# Altium schematic sheet Ethernet-PHY.SchDoc
size A4; SheetNumber: 5; SheetTotal: 5
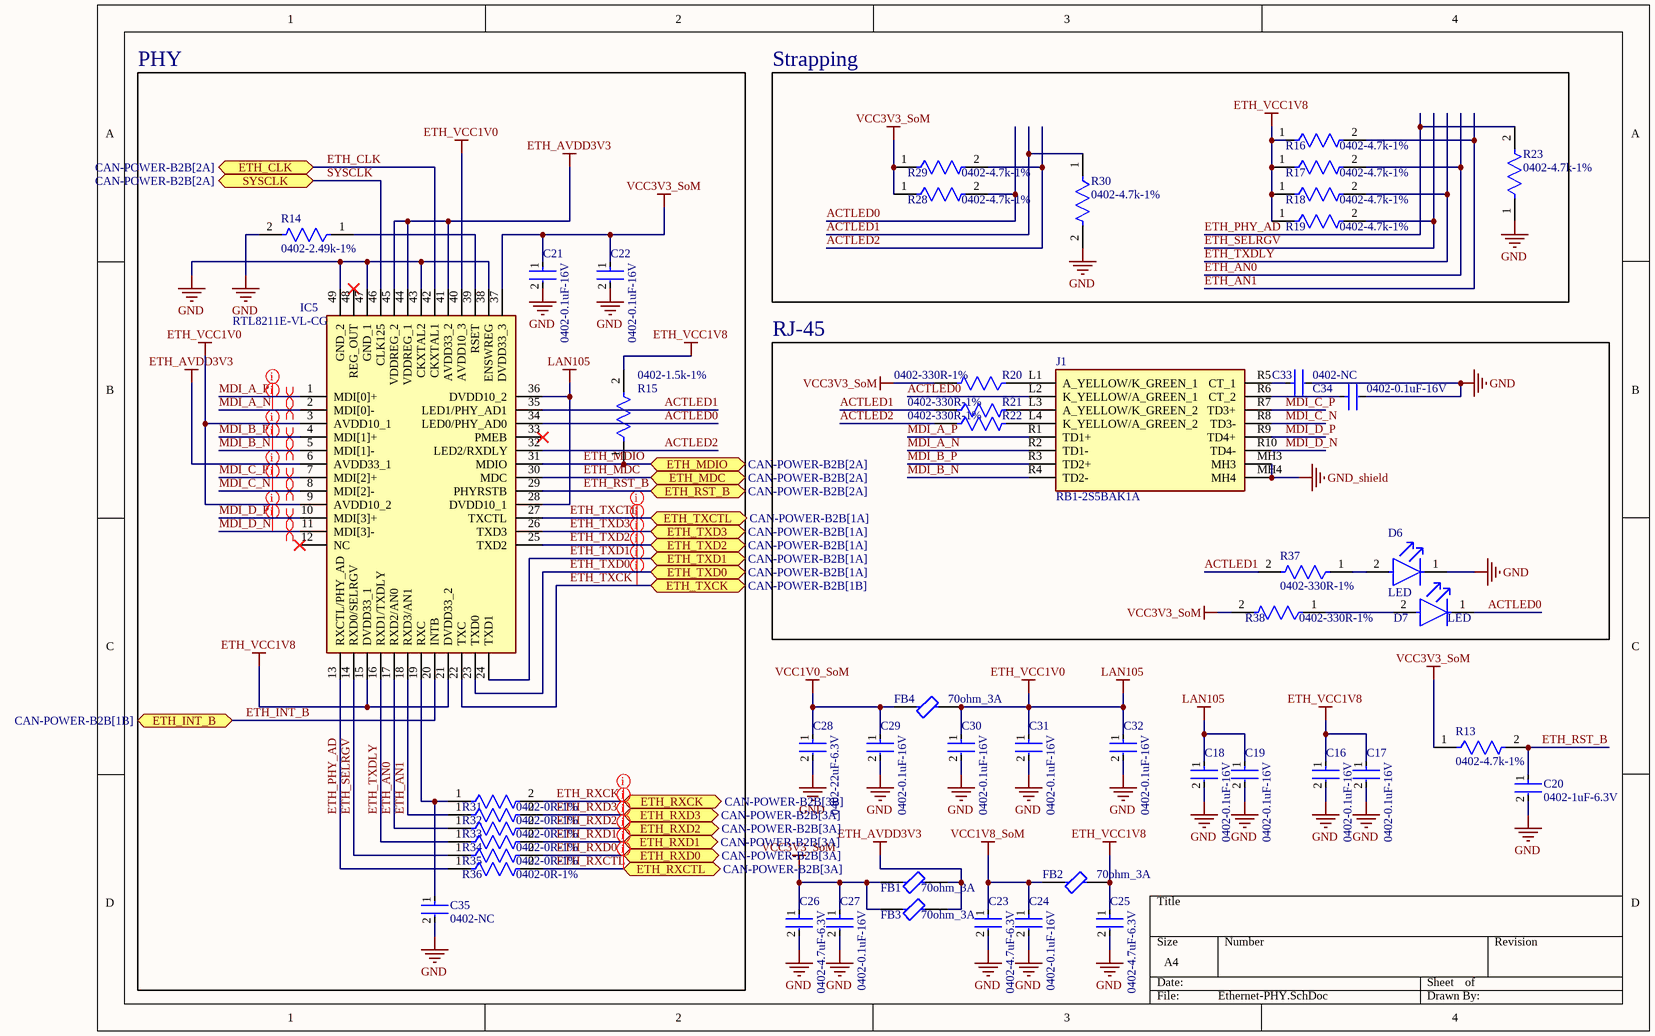
[diagram p0: Ethernet-PHY.SchDoc]

## Parts
C16  0402-0.1uF-16V  [FP-GRM155-0_05-IPC_A]
C17  0402-0.1uF-16V  [FP-GRM155-0_05-IPC_A]
C18  0402-0.1uF-16V  [FP-GRM155-0_05-IPC_A]
C19  0402-0.1uF-16V  [FP-GRM155-0_05-IPC_A]
C20  0402-1uF-6.3V  [FP-GRM155-0_05-IPC_A]
C21  0402-0.1uF-16V  [FP-GRM155-0_05-IPC_A]
C22  0402-0.1uF-16V  [FP-GRM155-0_05-IPC_A]
C23  0402-4.7uF-6.3V  [FP-GRM155-0_05-IPC_A]
C24  0402-0.1uF-16V  [FP-GRM155-0_05-IPC_A]
C25  0402-4.7uF-6.3V  [FP-GRM155-0_05-IPC_A]
C26  0402-4.7uF-6.3V  [FP-GRM155-0_05-IPC_A]
C27  0402-0.1uF-16V  [FP-GRM155-0_05-IPC_A]
C28  0402-22uF-6.3V  [FP-GRM155-0_05-IPC_A]
C29  0402-0.1uF-16V  [FP-GRM155-0_05-IPC_A]
C30  0402-0.1uF-16V  [FP-GRM155-0_05-IPC_A]
C31  0402-0.1uF-16V  [FP-GRM155-0_05-IPC_A]
C32  0402-0.1uF-16V  [FP-GRM155-0_05-IPC_A]
C33  0402-NC  [FP-GRM155-0_05-IPC_A]
C34  0402-0.1uF-16V  [FP-GRM155-0_05-IPC_A]
C35  0402-NC  [FP-GRM155-0_05-IPC_A]
D6  LED  [FP-APHHS1005CGCK-MFG]
D7  LED  [FP-APHHS1005CGCK-MFG]
FB1  70ohm_3A  [FP-MPZ2012-MFG]
FB2  70ohm_3A  [FP-MPZ2012-MFG]
FB3  70ohm_3A  [FP-MPZ2012-MFG]
FB4  70ohm_3A  [FP-MPZ2012-MFG]
IC5  RTL8211E-VL-CG  [QFN40P600X600X100-49N]
J1  RB1-2S5BAK1A  [RB12S5BAK1A]
R13  0402-4.7k-1%  [FP-CRCW0402-e3-IPC_C]
R14  0402-2.49k-1%  [FP-CRCW0402-e3-IPC_C]
R15  0402-1.5k-1%  [FP-CRCW0402-e3-IPC_C]
R16  0402-4.7k-1%  [FP-CRCW0402-e3-IPC_C]
R17  0402-4.7k-1%  [FP-CRCW0402-e3-IPC_C]
R18  0402-4.7k-1%  [FP-CRCW0402-e3-IPC_C]
R19  0402-4.7k-1%  [FP-CRCW0402-e3-IPC_C]
R20  0402-330R-1%  [FP-CRCW0402-e3-IPC_C]
R21  0402-330R-1%  [FP-CRCW0402-e3-IPC_C]
R22  0402-330R-1%  [FP-CRCW0402-e3-IPC_C]
R23  0402-4.7k-1%  [FP-CRCW0402-e3-IPC_C]
R28  0402-4.7k-1%  [FP-CRCW0402-e3-IPC_C]
R29  0402-4.7k-1%  [FP-CRCW0402-e3-IPC_C]
R30  0402-4.7k-1%  [FP-CRCW0402-e3-IPC_C]
R31  0402-0R-1%  [FP-CRCW0402-e3-IPC_C]
R32  0402-0R-1%  [FP-CRCW0402-e3-IPC_C]
R33  0402-0R-1%  [FP-CRCW0402-e3-IPC_C]
R34  0402-0R-1%  [FP-CRCW0402-e3-IPC_C]
R35  0402-0R-1%  [FP-CRCW0402-e3-IPC_C]
R36  0402-0R-1%  [FP-CRCW0402-e3-IPC_C]
R37  0402-330R-1%  [FP-CRCW0402-e3-IPC_C]
R38  0402-330R-1%  [FP-CRCW0402-e3-IPC_C]

## Blocks framed on the sheet
PHY: C21 C22 C35 IC5 R14 R15 R31-R36
Strapping: R16-R19 R23 R28-R30
RJ-45: C33 C34 D6 D7 J1 R20-R22 R37 R38

## Ports
ETH_CLK (bidir, see CAN-POWER-B2B[2A]), ETH_INT_B (bidir, see CAN-POWER-B2B[1B]), ETH_MDC (bidir, see CAN-POWER-B2B[2A]), ETH_MDIO (bidir, see CAN-POWER-B2B[2A]), ETH_RST_B (bidir, see CAN-POWER-B2B[2A]), ETH_RXCK (bidir, see CAN-POWER-B2B[3B]), ETH_RXCTL (bidir, see CAN-POWER-B2B[3A]), ETH_RXD0 (bidir, see CAN-POWER-B2B[3A]), ETH_RXD1 (bidir, see CAN-POWER-B2B[3A]), ETH_RXD2 (bidir, see CAN-POWER-B2B[3A]), ETH_RXD3 (bidir, see CAN-POWER-B2B[3A]), ETH_TXCK (bidir, see CAN-POWER-B2B[1B]), ETH_TXCTL (bidir, see CAN-POWER-B2B[1A]), ETH_TXD0 (bidir, see CAN-POWER-B2B[1A]), ETH_TXD1 (bidir, see CAN-POWER-B2B[1A]), ETH_TXD2 (bidir, see CAN-POWER-B2B[1A]), ETH_TXD3 (bidir, see CAN-POWER-B2B[1A]), SYSCLK (bidir, see CAN-POWER-B2B[2A])

## Nets
ETH_AVDD3V3: FB1.2 FB3.2 IC5.6(AVDD33_1) IC5.41(AVDD33_2) IC5.44(VDDREG_1) IC5.45(VDDREG_2)
ETH_VCC1V0: C18.1 C19.1 C30.1 C31.1 C32.1 FB4.2 IC5.3(AVDD10_1) IC5.9(AVDD10_2) IC5.28(DVDD10_1) IC5.36(DVDD10_2) IC5.40(AVDD10_3)  [also labelled LAN105]
ETH_VCC1V8: C16.1 C17.1 C25.1 FB2.2 IC5.15(DVDD33_1) IC5.21(DVDD33_2) R15.2 R16.1 R17.1 R18.1 R19.1
GND: C16.2 C17.2 C18.2 C19.2 C20.2 C21.2 C22.2 C23.2 C24.2 C25.2 C26.2 C27.2 C28.2 C29.2 C30.2 C31.2 C32.2 C33.2 C34.2 C35.2 D6.1(C) IC5.38(ENSWREG) IC5.43(CKXTAL2) IC5.47(GND_1) IC5.49(GND_2) R14.2 R23.1 R30.2
GND_shield: J1.MH3 J1.MH4
VCC1V0_SoM: C28.1 C29.1 FB4.1
VCC1V8_SoM: C23.1 C24.1 FB2.1
VCC3V3_SoM: C21.1 C22.1 C26.1 C27.1 FB1.1 FB3.1 IC5.37(DVDD33_3) R13.1 R20.2 R28.1 R29.1 R38.2
ACTLED0: D7.1(C) IC5.34(LED0/PHY_AD0) J1.L2(K_YELLOW/A_GREEN_1) R28.2
ACTLED1: IC5.35(LED1/PHY_AD1) R21.1 R30.1 R37.2
ACTLED2: IC5.32(LED2/RXDLY) R22.1 R29.2
ETH_AN0: IC5.17(RXD2/AN0) R17.2 R33.1
ETH_AN1: IC5.18(RXD3/AN1) R16.2 R32.1
ETH_CLK: IC5.42(CKXTAL1) ; port ETH_CLK
ETH_INT_B: IC5.20(INTB) ; port ETH_INT_B
ETH_MDC: IC5.30(MDC) ; port ETH_MDC
ETH_MDIO: IC5.31(MDIO) R15.1 ; port ETH_MDIO
ETH_PHY_AD: IC5.13(RXCTL/PHY_AD) R23.2 R36.1
ETH_RST_B: C20.1 IC5.29(PHYRSTB) R13.2 ; port ETH_RST_B
ETH_RXCK: R31.2 ; port ETH_RXCK
ETH_RXCTL: R36.2 ; port ETH_RXCTL
ETH_RXD0: R35.2 ; port ETH_RXD0
ETH_RXD1: R34.2 ; port ETH_RXD1
ETH_RXD2: R33.2 ; port ETH_RXD2
ETH_RXD3: R32.2 ; port ETH_RXD3
ETH_SELRGV: IC5.14(RXD0/SELRGV) R19.2 R35.1
ETH_TXCK: IC5.22(TXC) ; port ETH_TXCK
ETH_TXCTL: IC5.27(TXCTL) ; port ETH_TXCTL
ETH_TXD0: IC5.23(TXD0) ; port ETH_TXD0
ETH_TXD1: IC5.24(TXD1) ; port ETH_TXD1
ETH_TXD2: IC5.25(TXD2) ; port ETH_TXD2
ETH_TXD3: IC5.26(TXD3) ; port ETH_TXD3
ETH_TXDLY: IC5.16(RXD1/TXDLY) R18.2 R34.1
MDI_A_N: IC5.2(MDI[0]-) J1.R2(TD1-)
MDI_A_P: IC5.1(MDI[0]+) J1.R1(TD1+)
MDI_B_N: IC5.5(MDI[1]-) J1.R4(TD2-)
MDI_B_P: IC5.4(MDI[1]+) J1.R3(TD2+)
MDI_C_N: IC5.8(MDI[2]-) J1.R8(TD3-)
MDI_C_P: IC5.7(MDI[2]+) J1.R7(TD3+)
MDI_D_N: IC5.11(MDI[3]-) J1.R10(TD4-)
MDI_D_P: IC5.10(MDI[3]+) J1.R9(TD4+)
SYSCLK: IC5.46(CLK125) ; port SYSCLK
NetC33_1: C33.1 J1.R5(CT_1)
NetC34_1: C34.1 J1.R6(CT_2)
NetC35_1: C35.1 IC5.19(RXC) R31.1
NetD6_2: D6.2(A) R37.1
NetD7_2: D7.2(A) R38.1
NetIC5_39: IC5.39(RSET) R14.1
NetJ1_L1: J1.L1(A_YELLOW/K_GREEN_1) R20.1
NetJ1_L3: J1.L3(A_YELLOW/K_GREEN_2) R21.2
NetJ1_L4: J1.L4(K_YELLOW/A_GREEN_2) R22.2

Not connected (* = marked no-connect by the designer): IC5 12(NC)* 33(PMEB)* 48(REG_OUT)*

## Layout directives
differential pair: MDI_A_N, MDI_A_P, MDI_B_N, MDI_B_P, MDI_C_N, MDI_C_P, MDI_D_N, MDI_D_P
net class MDI: MDI_A_N, MDI_A_P, MDI_B_N, MDI_B_P, MDI_C_N, MDI_C_P, MDI_D_N, MDI_D_P
net class RGMII-TX: ETH_TXCK, ETH_TXCTL, ETH_TXD0, ETH_TXD1, ETH_TXD2, ETH_TXD3
net class RGMII-RX: ETH_RXCK, ETH_RXCTL, ETH_RXD0, ETH_RXD1, ETH_RXD2, ETH_RXD3

## Library data of the parts
C16-C35 = CMP-2008-04561-5: CAP CER 0.22UF 10V X5R 0402; Tolerance: 10%; Capacitance: 220nF; Material: Ceramic; Insulation Resistance: 10GR; Package Quantity: 1; Termination: SMD/SMT; Max Operating Temperature: 85°C; Voltage: 10V; REACH SVHC: No SVHC; Thickness: 0.022inch; Mount: Surface Mount; Height: 0.5mm; Length: 1mm; Lead Free: Lead Free; Number of Pins: 2; Case Code (Imperial): 0402; Case/Package: 0402; Min Operating Temperature: -55°C; Packaging: Tape and Reel; Dielectric: X5R; Depth: 0.5mm; Series: GRM; Case Code (Metric): 1005; Radiation Hardening: No; RoHS Compliant: Yes; Voltage Rating (DC): 10V; Voltage Rating: 10V; Dielectric Material: Ceramic; Width: 0.5mm
D6 D7 = CMP-44529-000044-1: LED GREEN CLEAR CHIP SMD; Viewing Angle: 120°; Dominant Wavelength: 570nm; Test Current: 20mA; Luminous Intensity: 50mcd; Forward Voltage: 2.1V; Number of LEDs: 1; Lens Color: Clear; Packaging: Tape and Reel; Max Operating Temperature: 85°C; Illumination Color: Green; Length: 1mm; Mount: Surface Mount; Lens Style: Clear; Color: Green; Number of Pins: 2; Wavelength: 570nm; Case/Package: 0402; Width: 0.5mm; Package Quantity: 2000; Case Code (Metric): 1005; Height: 0.6mm; Lead Free: Lead Free; Case Code (Imperial): 0402; Forward Current: 20mA; Min Operating Temperature: -40°C
FB1-FB4 = CMP-08257-000020-1: FERRITE BEAD 220 OHM 0805 1LN; Test Frequency: 100MHz; Max DC Current: 3A; Tolerance: 25%; Impedance: 220R; DC Resistance (DCR): 40mR; Case/Package: 0805; Mount: Surface Mount; Termination: SMD/SMT; Packaging: Tape and Reel; Core Material: Ferrite; Case Code (Metric): 2012; Length: 0.079inch; Width: 0.049inch; Case Code (Imperial): 0805; REACH SVHC: No SVHC; Weight: 0.000194oz; Current Rating: 3A; Min Operating Temperature: -55°C; Lead Free: Lead Free; Package Quantity: 4000; Max Operating Temperature: 125°C; RoHS Compliant: Yes; Depth: 1.25mm; Height: 0.85mm
IC5 = RTL8211E-VL-CG: Integrated Circuit; Manufacturer_Name: Realtek; Datasheet Link: https://datasheet.lcsc.com/lcsc/1810010421_Realtek-Semicon-RTL8211E-VB-CG_C90735.pdf; Height: 1mm; Manufacturer_Part_Number: RTL8211E-VL-CG
J1 = RB1-2S5BAK1A: Connector; Manufacturer_Name: UDE Corp; Datasheet Link: https://datasheet.lcsc.com/lcsc/1912111437_UDE-Corp-RB1-2S5BAK1A_C363232.pdf; Height: 13.6mm; Manufacturer_Part_Number: RB1-2S5BAK1A
R13-R23 R28-R38 = CMP-2002-08122-2: RES Thick Film, 0Ω, 0.063W, 0402; Tolerance: 5%; Max Power Dissipation: 63mW; Voltage Rating: 50V; Temperature Coefficient: 100ppm/°C; Resistance: 0mR; Contact Plating: Tin; Height: 0.35mm; Radiation Hardening: No; Features: Automotive AEC-Q200; Composition: Thick Film; Width: 0.5mm; Weight: 2.3E-05oz; Termination: SMD/SMT; Packaging: Tape and Reel; Mount: Surface Mount; Case Code (Metric): 1005; Military Standard: Not; Min Operating Temperature: -55°C; Number of Terminations: 2; Package Quantity: 1; Case Code (Imperial): 0402; Depth: 0.5mm; Max Operating Temperature: 155°C; Case/Package: 0402; Power Rating: 63mW; Lead Free: Lead Free; Voltage Rating (DC): 50V; Length: 1mm